# Altium schematic sheet [0X] - CPU_2.SchDoc
size A2; DocumentNumber: 2; SheetNumber: 2; SheetTotal: 4
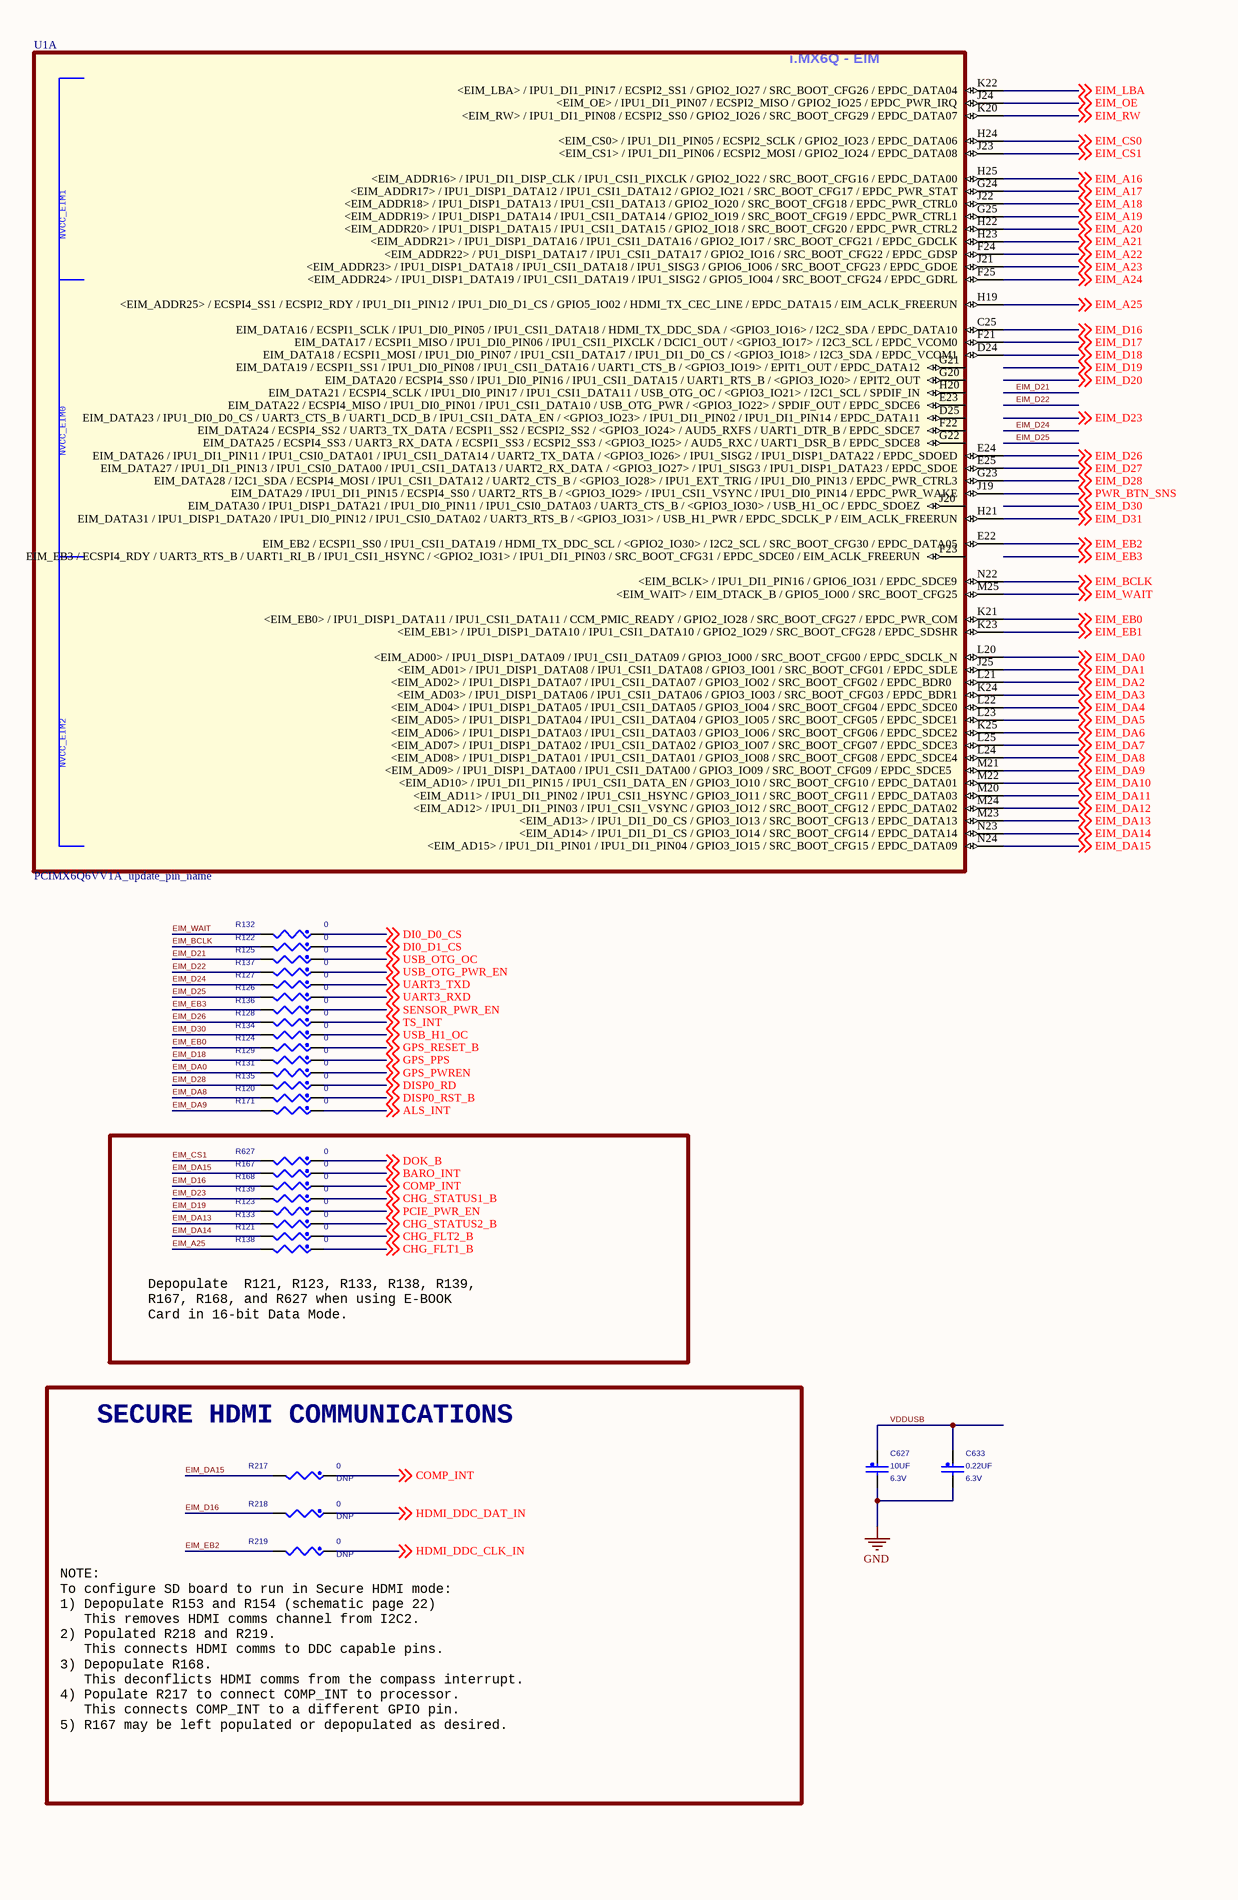
[diagram p0: [0X] - CPU_2.SchDoc, left]
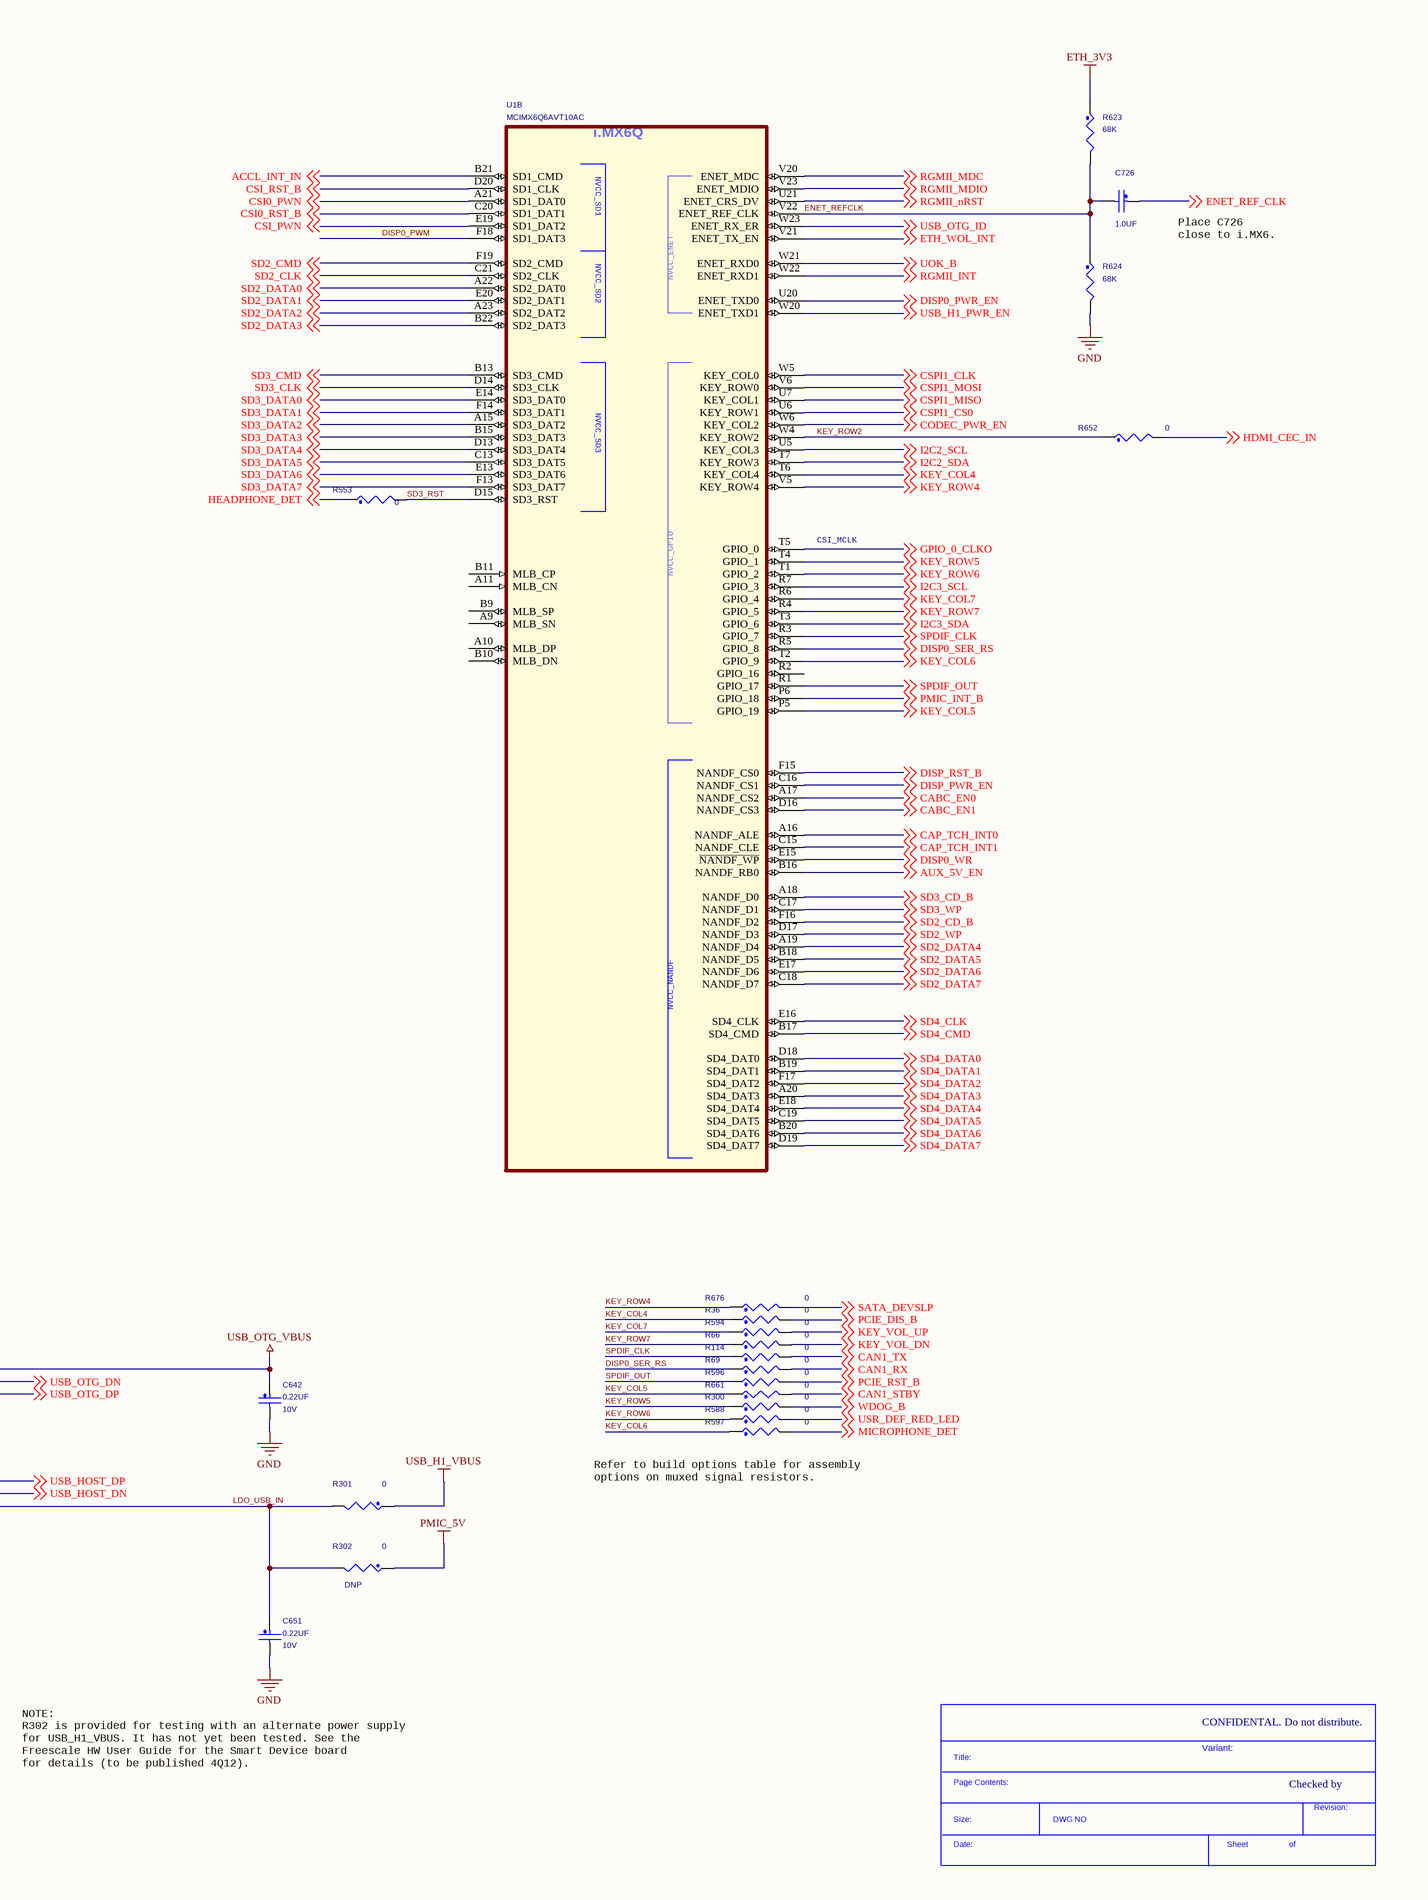
[diagram p1: [0X] - CPU_2.SchDoc, right]

## Parts
(Parts that share a designator on the sheet are numbered #1, #2 ... from top to bottom, then left to right.)
*  SDTitleBlock  (value not drawn)  (graphical)
C627  10UF  WVDC: 6.3V  [0603_CC]
C633  0.22UF  WVDC: 6.3V  [0201_CC]
C642  0.22UF  WVDC: 10V  [0201_CC]
C651  0.22UF  WVDC: 10V  [0201_CC]
C726  1.0UF  [0402_CC]
R36  0  [0402_CC]
R66  0  [0402_CC]
R69  0  [0402_CC]
R114  0  [0402_CC]
R120  0  [0402_CC]
R121  0  [0402_CC]
R122  0  [0402_CC]
R123  0  [0402_CC]
R124  0  [0402_CC]
R125  0  [0402_CC]
R126  0  [0402_CC]
R127  0  [0402_CC]
R128  0  [0402_CC]
R129  0  [0402_CC]
R131  0  [0402_CC]
R132  0  [0402_CC]
R133  0  [0402_CC]
R134  0  [0402_CC]
R135  0  [0402_CC]
R136  0  [0402_CC]
R137  0  [0402_CC]
R138  0  [0402_CC]
R139  0  [0402_CC]
R167  0  [0402_CC]
R168  0  [0402_CC]
R171  0  [0402_CC]
R217  0  ASSY_OPT: DNP  [0402_CC]
R218  0  ASSY_OPT: DNP  [0402_CC]
R219  0  ASSY_OPT: DNP  [0402_CC]
R300  0  [0402_CC]
R301  0  [0402_CC]
R302  0  ASSY_OPT: DNP  [0402_CC]
R553  0  [0402_CC]
R588  0  [0402_CC]
R594  0  [0402_CC]
R596  0  [0402_CC]
R597  0  [0402_CC]
R623  68K  [0402_CC]
R624  68K  [0402_CC]
R627  0  [0402_CC]
R652  0  [0402_CC]
R661  0  [0402_CC]
R676  0  [0402_CC]
U1#1  PCIMX6Q6VV1A_update_pin_name  (part A of 17)
U1#2  MCIMX6Q6AVT10AC  [BGA624_0P8_21X21]  (part B of 12)

## Blocks framed on the sheet
SECURE HDMI COMMUNICATIONS: R217-R219

## Nets
ETH_3V3: R623.1
GND: C627.2 C633.2 C642.2 C651.2 R624.2
PMIC_5V: R302.1
USB_H1_VBUS: R301.1
USB_OTG_VBUS: C642.1
ACCL_INT_IN: U1#2.B21(SD1_CMD) ; off-sheet ACCL_INT_IN
ALS_INT: R171.1 ; off-sheet ALS_INT
AUX_5V_EN: U1#2.B16(NANDF_RB0) ; off-sheet AUX_5V_EN
BARO_INT: R167.1 ; off-sheet BARO_INT
CABC_EN0: U1#2.A17(NANDF_CS2) ; off-sheet CABC_EN0
CABC_EN1: U1#2.D16(NANDF_CS3) ; off-sheet CABC_EN1
CAN1_RX: R69.2 ; off-sheet CAN1_RX
CAN1_STBY: R661.2 ; off-sheet CAN1_STBY
CAN1_TX: R114.2 ; off-sheet CAN1_TX
CAP_TCH_INT0: U1#2.A16(NANDF_ALE) ; off-sheet CAP_TCH_INT0
CAP_TCH_INT1: U1#2.C15(NANDF_CLE) ; off-sheet CAP_TCH_INT1
CHG_FLT1_B: R138.1 ; off-sheet CHG_FLT1_B
CHG_FLT2_B: R121.1 ; off-sheet CHG_FLT2_B
CHG_STATUS1_B: R139.1 ; off-sheet CHG_STATUS1_B
CHG_STATUS2_B: R133.1 ; off-sheet CHG_STATUS2_B
CODEC_PWR_EN: U1#2.W6(KEY_COL2) ; off-sheet CODEC_PWR_EN
COMP_INT: R168.1 R217.1 ; off-sheet COMP_INT
CSI0_PWN: U1#2.A21(SD1_DAT0) ; off-sheet CSI0_PWN
CSI0_RST_B: U1#2.C20(SD1_DAT1) ; off-sheet CSI0_RST_B
CSI_PWN: U1#2.E19(SD1_DAT2) ; off-sheet CSI_PWN
CSI_RST_B: U1#2.D20(SD1_CLK) ; off-sheet CSI_RST_B
CSPI1_CLK: U1#2.W5(KEY_COL0) ; off-sheet CSPI1_CLK
CSPI1_CS0: U1#2.U6(KEY_ROW1) ; off-sheet CSPI1_CS0
CSPI1_MISO: U1#2.U7(KEY_COL1) ; off-sheet CSPI1_MISO
CSPI1_MOSI: U1#2.V6(KEY_ROW0) ; off-sheet CSPI1_MOSI
DI0_D0_CS: R132.1 ; off-sheet DI0_D0_CS
DI0_D1_CS: R122.1 ; off-sheet DI0_D1_CS
DISP0_PWM: U1#2.F18(SD1_DAT3)
DISP0_PWR_EN: U1#2.U20(ENET_TXD0) ; off-sheet DISP0_PWR_EN
DISP0_RD: R135.1 ; off-sheet DISP0_RD
DISP0_RST_B: R120.1 ; off-sheet DISP0_RST_B
DISP0_SER_RS: R69.1 U1#2.R5(GPIO_8) ; off-sheet DISP0_SER_RS
DISP0_WR: U1#2.E15(~{NANDF_WP}) ; off-sheet DISP0_WR
DISP_PWR_EN: U1#2.C16(NANDF_CS1) ; off-sheet DISP_PWR_EN
DISP_RST_B: U1#2.F15(NANDF_CS0) ; off-sheet DISP_RST_B
DOK_B: R627.1 ; off-sheet DOK_B
EIM_A16: U1#1.H25(<EIM_ADDR16>_/_IPU1_DI1_DISP_CLK_/_IPU1_CSI1_PIXCLK_/_GPIO2_IO22_/_SRC_BOOT_CFG16_/_EPDC_DATA00) ; off-sheet EIM_A16
EIM_A17: U1#1.G24(<EIM_ADDR17>_/_IPU1_DISP1_DATA12_/_IPU1_CSI1_DATA12_/_GPIO2_IO21_/_SRC_BOOT_CFG17_/_EPDC_PWR_STAT) ; off-sheet EIM_A17
EIM_A18: U1#1.J22(<EIM_ADDR18>_/_IPU1_DISP1_DATA13_/_IPU1_CSI1_DATA13_/_GPIO2_IO20_/_SRC_BOOT_CFG18_/_EPDC_PWR_CTRL0) ; off-sheet EIM_A18
EIM_A19: U1#1.G25(<EIM_ADDR19>_/_IPU1_DISP1_DATA14_/_IPU1_CSI1_DATA14_/_GPIO2_IO19_/_SRC_BOOT_CFG19_/_EPDC_PWR_CTRL1) ; off-sheet EIM_A19
EIM_A20: U1#1.H22(<EIM_ADDR20>_/_IPU1_DISP1_DATA15_/_IPU1_CSI1_DATA15_/_GPIO2_IO18_/_SRC_BOOT_CFG20_/_EPDC_PWR_CTRL2) ; off-sheet EIM_A20
EIM_A21: U1#1.H23(<EIM_ADDR21>_/_IPU1_DISP1_DATA16_/_IPU1_CSI1_DATA16_/_GPIO2_IO17_/_SRC_BOOT_CFG21_/_EPDC_GDCLK) ; off-sheet EIM_A21
EIM_A22: U1#1.F24(<EIM_ADDR22>_/_PU1_DISP1_DATA17_/_IPU1_CSI1_DATA17_/_GPIO2_IO16_/_SRC_BOOT_CFG22_/_EPDC_GDSP) ; off-sheet EIM_A22
EIM_A23: U1#1.J21(<EIM_ADDR23>_/_IPU1_DISP1_DATA18_/_IPU1_CSI1_DATA18_/_IPU1_SISG3_/_GPIO6_IO06_/_SRC_BOOT_CFG23_/_EPDC_GDOE) ; off-sheet EIM_A23
EIM_A24: U1#1.F25(<EIM_ADDR24>_/_IPU1_DISP1_DATA19_/_IPU1_CSI1_DATA19_/_IPU1_SISG2_/_GPIO5_IO04_/_SRC_BOOT_CFG24_/_EPDC_GDRL) ; off-sheet EIM_A24
EIM_A25: R138.2 U1#1.H19(<EIM_ADDR25>_/_ECSPI4_SS1_/_ECSPI2_RDY_/_IPU1_DI1_PIN12_/_IPU1_DI0_D1_CS_/_GPIO5_IO02_/_HDMI_TX_CEC_LINE_/_EPDC_DATA15_/_EIM_ACLK_FREERUN) ; off-sheet EIM_A25
EIM_BCLK: R122.2 U1#1.N22(<EIM_BCLK>_/_IPU1_DI1_PIN16_/_GPIO6_IO31_/_EPDC_SDCE9) ; off-sheet EIM_BCLK
EIM_CS0: U1#1.H24(<EIM_CS0>_/_IPU1_DI1_PIN05_/_ECSPI2_SCLK_/_GPIO2_IO23_/_EPDC_DATA06) ; off-sheet EIM_CS0
EIM_CS1: R627.2 U1#1.J23(<EIM_CS1>_/_IPU1_DI1_PIN06_/_ECSPI2_MOSI_/_GPIO2_IO24_/_EPDC_DATA08) ; off-sheet EIM_CS1
EIM_D16: R168.2 R218.2 U1#1.C25(EIM_DATA16_/_ECSPI1_SCLK_/_IPU1_DI0_PIN05_/_IPU1_CSI1_DATA18_/_HDMI_TX_DDC_SDA_/_<GPIO3_IO16>_/_I2C2_SDA_/_EPDC_DATA10) ; off-sheet EIM_D16
EIM_D17: U1#1.F21(EIM_DATA17_/_ECSPI1_MISO_/_IPU1_DI0_PIN06_/_IPU1_CSI1_PIXCLK_/_DCIC1_OUT_/_<GPIO3_IO17>_/_I2C3_SCL_/_EPDC_VCOM0) ; off-sheet EIM_D17
EIM_D18: R129.2 U1#1.D24(EIM_DATA18_/_ECSPI1_MOSI_/_IPU1_DI0_PIN07_/_IPU1_CSI1_DATA17_/_IPU1_DI1_D0_CS_/_<GPIO3_IO18>_/_I2C3_SDA_/_EPDC_VCOM1) ; off-sheet EIM_D18
EIM_D19: R123.2 ; off-sheet EIM_D19
EIM_D21: R125.2
EIM_D22: R137.2
EIM_D23: R139.2 ; off-sheet EIM_D23
EIM_D24: R127.2
EIM_D25: R126.2
EIM_D26: R128.2 U1#1.E24(EIM_DATA26_/_IPU1_DI1_PIN11_/_IPU1_CSI0_DATA01_/_IPU1_CSI1_DATA14_/_UART2_TX_DATA_/_<GPIO3_IO26>_/_IPU1_SISG2_/_IPU1_DISP1_DATA22_/_EPDC_SDOED) ; off-sheet EIM_D26
EIM_D27: U1#1.E25(EIM_DATA27_/_IPU1_DI1_PIN13_/_IPU1_CSI0_DATA00_/_IPU1_CSI1_DATA13_/_UART2_RX_DATA_/_<GPIO3_IO27>_/_IPU1_SISG3_/_IPU1_DISP1_DATA23_/_EPDC_SDOE) ; off-sheet EIM_D27
EIM_D28: R135.2 U1#1.G23(EIM_DATA28_/_I2C1_SDA_/_ECSPI4_MOSI_/_IPU1_CSI1_DATA12_/_UART2_CTS_B_/_<GPIO3_IO28>_/_IPU1_EXT_TRIG_/_IPU1_DI0_PIN13_/_EPDC_PWR_CTRL3) ; off-sheet EIM_D28
EIM_D30: R134.2 ; off-sheet EIM_D30
EIM_D31: U1#1.H21(EIM_DATA31_/_IPU1_DISP1_DATA20_/_IPU1_DI0_PIN12_/_IPU1_CSI0_DATA02_/_UART3_RTS_B_/_<GPIO3_IO31>_/_USB_H1_PWR_/_EPDC_SDCLK_P_/_EIM_ACLK_FREERUN) ; off-sheet EIM_D31
EIM_DA0: R131.2 U1#1.L20(<EIM_AD00>_/_IPU1_DISP1_DATA09_/_IPU1_CSI1_DATA09_/_GPIO3_IO00_/_SRC_BOOT_CFG00_/_EPDC_SDCLK_N) ; off-sheet EIM_DA0
EIM_DA1: U1#1.J25(<EIM_AD01>_/_IPU1_DISP1_DATA08_/_IPU1_CSI1_DATA08_/_GPIO3_IO01_/_SRC_BOOT_CFG01_/_EPDC_SDLE) ; off-sheet EIM_DA1
EIM_DA2: U1#1.L21(<EIM_AD02>_/_IPU1_DISP1_DATA07_/_IPU1_CSI1_DATA07_/_GPIO3_IO02_/_SRC_BOOT_CFG02_/_EPDC_BDR0) ; off-sheet EIM_DA2
EIM_DA3: U1#1.K24(<EIM_AD03>_/_IPU1_DISP1_DATA06_/_IPU1_CSI1_DATA06_/_GPIO3_IO03_/_SRC_BOOT_CFG03_/_EPDC_BDR1) ; off-sheet EIM_DA3
EIM_DA4: U1#1.L22(<EIM_AD04>_/_IPU1_DISP1_DATA05_/_IPU1_CSI1_DATA05_/_GPIO3_IO04_/_SRC_BOOT_CFG04_/_EPDC_SDCE0) ; off-sheet EIM_DA4
EIM_DA5: U1#1.L23(<EIM_AD05>_/_IPU1_DISP1_DATA04_/_IPU1_CSI1_DATA04_/_GPIO3_IO05_/_SRC_BOOT_CFG05_/_EPDC_SDCE1) ; off-sheet EIM_DA5
EIM_DA6: U1#1.K25(<EIM_AD06>_/_IPU1_DISP1_DATA03_/_IPU1_CSI1_DATA03_/_GPIO3_IO06_/_SRC_BOOT_CFG06_/_EPDC_SDCE2) ; off-sheet EIM_DA6
EIM_DA7: U1#1.L25(<EIM_AD07>_/_IPU1_DISP1_DATA02_/_IPU1_CSI1_DATA02_/_GPIO3_IO07_/_SRC_BOOT_CFG07_/_EPDC_SDCE3) ; off-sheet EIM_DA7
EIM_DA8: R120.2 U1#1.L24(<EIM_AD08>_/_IPU1_DISP1_DATA01_/_IPU1_CSI1_DATA01_/_GPIO3_IO08_/_SRC_BOOT_CFG08_/_EPDC_SDCE4) ; off-sheet EIM_DA8
EIM_DA9: R171.2 U1#1.M21(<EIM_AD09>_/_IPU1_DISP1_DATA00_/_IPU1_CSI1_DATA00_/_GPIO3_IO09_/_SRC_BOOT_CFG09_/_EPDC_SDCE5) ; off-sheet EIM_DA9
EIM_DA10: U1#1.M22(<EIM_AD10>_/_IPU1_DI1_PIN15_/_IPU1_CSI1_DATA_EN_/_GPIO3_IO10_/_SRC_BOOT_CFG10_/_EPDC_DATA01) ; off-sheet EIM_DA10
EIM_DA11: U1#1.M20(<EIM_AD11>_/_IPU1_DI1_PIN02_/_IPU1_CSI1_HSYNC_/_GPIO3_IO11_/_SRC_BOOT_CFG11_/_EPDC_DATA03) ; off-sheet EIM_DA11
EIM_DA12: U1#1.M24(<EIM_AD12>_/_IPU1_DI1_PIN03_/_IPU1_CSI1_VSYNC_/_GPIO3_IO12_/_SRC_BOOT_CFG12_/_EPDC_DATA02) ; off-sheet EIM_DA12
EIM_DA13: R133.2 U1#1.M23(<EIM_AD13>_/_IPU1_DI1_D0_CS_/_GPIO3_IO13_/_SRC_BOOT_CFG13_/_EPDC_DATA13) ; off-sheet EIM_DA13
EIM_DA14: R121.2 U1#1.N23(<EIM_AD14>_/_IPU1_DI1_D1_CS_/_GPIO3_IO14_/_SRC_BOOT_CFG14_/_EPDC_DATA14) ; off-sheet EIM_DA14
EIM_DA15: R167.2 R217.2 U1#1.N24(<EIM_AD15>_/_IPU1_DI1_PIN01_/_IPU1_DI1_PIN04_/_GPIO3_IO15_/_SRC_BOOT_CFG15_/_EPDC_DATA09) ; off-sheet EIM_DA15
EIM_EB0: R124.2 U1#1.K21(<EIM_EB0>_/_IPU1_DISP1_DATA11_/_IPU1_CSI1_DATA11_/_CCM_PMIC_READY_/_GPIO2_IO28_/_SRC_BOOT_CFG27_/_EPDC_PWR_COM) ; off-sheet EIM_EB0
EIM_EB1: U1#1.K23(<EIM_EB1>_/_IPU1_DISP1_DATA10_/_IPU1_CSI1_DATA10_/_GPIO2_IO29_/_SRC_BOOT_CFG28_/_EPDC_SDSHR) ; off-sheet EIM_EB1
EIM_EB2: R219.2 U1#1.E22(EIM_EB2_/_ECSPI1_SS0_/_IPU1_CSI1_DATA19_/_HDMI_TX_DDC_SCL_/_<GPIO2_IO30>_/_I2C2_SCL_/_SRC_BOOT_CFG30_/_EPDC_DATA05) ; off-sheet EIM_EB2
EIM_EB3: R136.2 ; off-sheet EIM_EB3
EIM_LBA: U1#1.K22(<EIM_LBA>_/_IPU1_DI1_PIN17_/_ECSPI2_SS1_/_GPIO2_IO27_/_SRC_BOOT_CFG26_/_EPDC_DATA04) ; off-sheet EIM_LBA
EIM_OE: U1#1.J24(<EIM_OE>_/_IPU1_DI1_PIN07_/_ECSPI2_MISO_/_GPIO2_IO25_/_EPDC_PWR_IRQ) ; off-sheet EIM_OE
EIM_RW: U1#1.K20(<EIM_RW>_/_IPU1_DI1_PIN08_/_ECSPI2_SS0_/_GPIO2_IO26_/_SRC_BOOT_CFG29_/_EPDC_DATA07) ; off-sheet EIM_RW
EIM_WAIT: R132.2 U1#1.M25(<EIM_WAIT>_/_EIM_DTACK_B_/_GPIO5_IO00_/_SRC_BOOT_CFG25) ; off-sheet EIM_WAIT
ENET_REF_CLK: C726.1 ; off-sheet ENET_REF_CLK
ENET_REFCLK: C726.2 R623.2 R624.1 U1#2.V22(ENET_REF_CLK)
ETH_WOL_INT: U1#2.V21(ENET_TX_EN) ; off-sheet ETH_WOL_INT
GPIO_0_CLKO: U1#2.T5(GPIO_0) ; off-sheet GPIO_0_CLKO
GPS_PPS: R129.1 ; off-sheet GPS_PPS
GPS_PWREN: R131.1 ; off-sheet GPS_PWREN
GPS_RESET_B: R124.1 ; off-sheet GPS_RESET_B
HDMI_CEC_IN: R652.2 ; off-sheet HDMI_CEC_IN
HDMI_DDC_CLK_IN: R219.1 ; off-sheet HDMI_DDC_CLK_IN
HDMI_DDC_DAT_IN: R218.1 ; off-sheet HDMI_DDC_DAT_IN
HEADPHONE_DET: R553.1 ; off-sheet HEADPHONE_DET
I2C2_SCL: U1#2.U5(KEY_COL3) ; off-sheet I2C2_SCL
I2C2_SDA: U1#2.T7(KEY_ROW3) ; off-sheet I2C2_SDA
I2C3_SCL: U1#2.R7(GPIO_3) ; off-sheet I2C3_SCL
I2C3_SDA: U1#2.T3(GPIO_6) ; off-sheet I2C3_SDA
KEY_COL4: R36.1 U1#2.T6(KEY_COL4) ; off-sheet KEY_COL4
KEY_COL5: R661.1 U1#2.P5(GPIO_19) ; off-sheet KEY_COL5
KEY_COL6: R597.1 U1#2.T2(GPIO_9) ; off-sheet KEY_COL6
KEY_COL7: R594.1 U1#2.R6(GPIO_4) ; off-sheet KEY_COL7
KEY_ROW2: R652.1 U1#2.W4(KEY_ROW2)
KEY_ROW4: R676.1 U1#2.V5(KEY_ROW4) ; off-sheet KEY_ROW4
KEY_ROW5: R300.1 U1#2.T4(GPIO_1) ; off-sheet KEY_ROW5
KEY_ROW6: R588.1 U1#2.T1(GPIO_2) ; off-sheet KEY_ROW6
KEY_ROW7: R66.1 U1#2.R4(GPIO_5) ; off-sheet KEY_ROW7
KEY_VOL_DN: R66.2 ; off-sheet KEY_VOL_DN
KEY_VOL_UP: R594.2 ; off-sheet KEY_VOL_UP
LDO_USB_IN: C651.1 R301.2 R302.2
MICROPHONE_DET: R597.2 ; off-sheet MICROPHONE_DET
PCIE_DIS_B: R36.2 ; off-sheet PCIE_DIS_B
PCIE_PWR_EN: R123.1 ; off-sheet PCIE_PWR_EN
PCIE_RST_B: R596.2 ; off-sheet PCIE_RST_B
PMIC_INT_B: U1#2.P6(GPIO_18) ; off-sheet PMIC_INT_B
PWR_BTN_SNS: U1#1.J19(EIM_DATA29_/_IPU1_DI1_PIN15_/_ECSPI4_SS0_/_UART2_RTS_B_/_<GPIO3_IO29>_/_IPU1_CSI1_VSYNC_/_IPU1_DI0_PIN14_/_EPDC_PWR_WAKE) ; off-sheet PWR_BTN_SNS
RGMII_INT: U1#2.W22(ENET_RXD1) ; off-sheet RGMII_INT
RGMII_MDC: U1#2.V20(ENET_MDC) ; off-sheet RGMII_MDC
RGMII_MDIO: U1#2.V23(ENET_MDIO) ; off-sheet RGMII_MDIO
RGMII_nRST: U1#2.U21(ENET_CRS_DV) ; off-sheet RGMII_nRST
SATA_DEVSLP: R676.2 ; off-sheet SATA_DEVSLP
SD2_CD_B: U1#2.F16(NANDF_D2) ; off-sheet SD2_CD_B
SD2_CLK: U1#2.C21(SD2_CLK) ; off-sheet SD2_CLK
SD2_CMD: U1#2.F19(SD2_CMD) ; off-sheet SD2_CMD
SD2_DATA0: U1#2.A22(SD2_DAT0) ; off-sheet SD2_DATA0
SD2_DATA1: U1#2.E20(SD2_DAT1) ; off-sheet SD2_DATA1
SD2_DATA2: U1#2.A23(SD2_DAT2) ; off-sheet SD2_DATA2
SD2_DATA3: U1#2.B22(SD2_DAT3) ; off-sheet SD2_DATA3
SD2_DATA4: U1#2.A19(NANDF_D4) ; off-sheet SD2_DATA4
SD2_DATA5: U1#2.B18(NANDF_D5) ; off-sheet SD2_DATA5
SD2_DATA6: U1#2.E17(NANDF_D6) ; off-sheet SD2_DATA6
SD2_DATA7: U1#2.C18(NANDF_D7) ; off-sheet SD2_DATA7
SD2_WP: U1#2.D17(NANDF_D3) ; off-sheet SD2_WP
SD3_CD_B: U1#2.A18(NANDF_D0) ; off-sheet SD3_CD_B
SD3_CLK: U1#2.D14(SD3_CLK) ; off-sheet SD3_CLK
SD3_CMD: U1#2.B13(SD3_CMD) ; off-sheet SD3_CMD
SD3_DATA0: U1#2.E14(SD3_DAT0) ; off-sheet SD3_DATA0
SD3_DATA1: U1#2.F14(SD3_DAT1) ; off-sheet SD3_DATA1
SD3_DATA2: U1#2.A15(SD3_DAT2) ; off-sheet SD3_DATA2
SD3_DATA3: U1#2.B15(SD3_DAT3) ; off-sheet SD3_DATA3
SD3_DATA4: U1#2.D13(SD3_DAT4) ; off-sheet SD3_DATA4
SD3_DATA5: U1#2.C13(SD3_DAT5) ; off-sheet SD3_DATA5
SD3_DATA6: U1#2.E13(SD3_DAT6) ; off-sheet SD3_DATA6
SD3_DATA7: U1#2.F13(SD3_DAT7) ; off-sheet SD3_DATA7
SD3_RST: R553.2 U1#2.D15(SD3_RST)
SD3_WP: U1#2.C17(NANDF_D1) ; off-sheet SD3_WP
SD4_CLK: U1#2.E16(SD4_CLK) ; off-sheet SD4_CLK
SD4_CMD: U1#2.B17(SD4_CMD) ; off-sheet SD4_CMD
SD4_DATA0: U1#2.D18(SD4_DAT0) ; off-sheet SD4_DATA0
SD4_DATA1: U1#2.B19(SD4_DAT1) ; off-sheet SD4_DATA1
SD4_DATA2: U1#2.F17(SD4_DAT2) ; off-sheet SD4_DATA2
SD4_DATA3: U1#2.A20(SD4_DAT3) ; off-sheet SD4_DATA3
SD4_DATA4: U1#2.E18(SD4_DAT4) ; off-sheet SD4_DATA4
SD4_DATA5: U1#2.C19(SD4_DAT5) ; off-sheet SD4_DATA5
SD4_DATA6: U1#2.B20(SD4_DAT6) ; off-sheet SD4_DATA6
SD4_DATA7: U1#2.D19(SD4_DAT7) ; off-sheet SD4_DATA7
SENSOR_PWR_EN: R136.1 ; off-sheet SENSOR_PWR_EN
SPDIF_CLK: R114.1 U1#2.R3(GPIO_7) ; off-sheet SPDIF_CLK
SPDIF_OUT: R596.1 U1#2.R1(GPIO_17) ; off-sheet SPDIF_OUT
TS_INT: R128.1 ; off-sheet TS_INT
UART3_RXD: R126.1 ; off-sheet UART3_RXD
UART3_TXD: R127.1 ; off-sheet UART3_TXD
UOK_B: U1#2.W21(ENET_RXD0) ; off-sheet UOK_B
USB_H1_OC: R134.1 ; off-sheet USB_H1_OC
USB_H1_PWR_EN: U1#2.W20(ENET_TXD1) ; off-sheet USB_H1_PWR_EN
USB_OTG_ID: U1#2.W23(ENET_RX_ER) ; off-sheet USB_OTG_ID
USB_OTG_OC: R125.1 ; off-sheet USB_OTG_OC
USB_OTG_PWR_EN: R137.1 ; off-sheet USB_OTG_PWR_EN
USR_DEF_RED_LED: R588.2 ; off-sheet USR_DEF_RED_LED
VDDUSB: C627.1 C633.1
WDOG_B: R300.2 ; off-sheet WDOG_B

Not connected (* = marked no-connect by the designer): U1#1 D25(EIM_DATA23_/_IPU1_DI0_D0_CS_/_UART3_CTS_B_/_UART1_DCD_B_/_IPU1_CSI1_DATA_EN_/_<GPIO3_IO23>_/_IPU1_DI1_PIN02_/_IPU1_DI1_PIN14_/_EPDC_DATA11) E23(__EIM_DATA22_/_ECSPI4_MISO_/_IPU1_DI0_PIN01_/_IPU1_CSI1_DATA10_/_USB_OTG_PWR_/_<GPIO3_IO22>_/_SPDIF_OUT_/_EPDC_SDCE6) F22(__EIM_DATA24_/_ECSPI4_SS2_/_UART3_TX_DATA_/_ECSPI1_SS2_/_ECSPI2_SS2_/_<GPIO3_IO24>_/_AUD5_RXFS_/_UART1_DTR_B_/_EPDC_SDCE7) F23(EIM_EB3_/_ECSPI4_RDY_/_UART3_RTS_B_/_UART1_RI_B_/_IPU1_CSI1_HSYNC_/_<GPIO2_IO31>_/_IPU1_DI1_PIN03_/_SRC_BOOT_CFG31_/_EPDC_SDCE0_/_EIM_ACLK_FREERUN) G20(EIM_DATA20_/_ECSPI4_SS0_/_IPU1_DI0_PIN16_/_IPU1_CSI1_DATA15_/_UART1_RTS_B_/_<GPIO3_IO20>_/_EPIT2_OUT) G21(__EIM_DATA19_/_ECSPI1_SS1_/_IPU1_DI0_PIN08_/_IPU1_CSI1_DATA16_/_UART1_CTS_B_/_<GPIO3_IO19>_/_EPIT1_OUT_/_EPDC_DATA12) G22(__EIM_DATA25_/_ECSPI4_SS3_/_UART3_RX_DATA_/_ECSPI1_SS3_/_ECSPI2_SS3_/_<GPIO3_IO25>_/_AUD5_RXC_/_UART1_DSR_B_/_EPDC_SDCE8) H20(EIM_DATA21_/_ECSPI4_SCLK_/_IPU1_DI0_PIN17_/_IPU1_CSI1_DATA11_/_USB_OTG_OC_/_<GPIO3_IO21>_/_I2C1_SCL_/_SPDIF_IN) J20(__EIM_DATA30_/_IPU1_DISP1_DATA21_/_IPU1_DI0_PIN11_/_IPU1_CSI0_DATA03_/_UART3_CTS_B_/_<GPIO3_IO30>_/_USB_H1_OC_/_EPDC_SDOEZ); U1#2 A9(MLB_SN) A10(MLB_DP) A11(MLB_CN) B9(MLB_SP) B10(MLB_DN) B11(MLB_CP) R2(GPIO_16)

## Notes on the sheet
- Place C726
  close to i.MX6.
- CSI_MCLK
- Depopulate  R121, R123, R133, R138, R139,
  R167, R168, and R627 when using E-BOOK
  Card in 16-bit Data Mode.
- Refer to build options table for assembly
  options on muxed signal resistors.
- CONFIDENTAL. Do not distribute.
- (near R219) NOTE:
  To configure SD board to run in Secure HDMI mode:
  1) Depopulate R153 and R154 (schematic page 22)
  This removes HDMI comms channel from I2C2.
  2) Populated R218 and R219.
  This connects HDMI comms to DDC capable pins.
  3) Depopulate R168.
  This deconflicts HDMI comms from the compass interrupt.
  4) Populate R217 to connect COMP_INT to processor.
  This connects COMP_INT to a different GPIO pin.
  5) R167 may be left populated or depopulated as desired.
- CLOCKS (CPU & PCIE)
- NOTE:
  R302 is provided for testing with an alternate power supply
  for USB_H1_VBUS. It has not yet been tested. See the
  Freescale HW User Guide for the Smart Device board
  for details (to be published 4Q12).
- Variant:
- Checked by
- (in symbol PCIMX6Q6VV1A, part B) i.MX6Q
- (in symbol PCIMX6Q6VV1A_update_pin_name, part A) i.MX6Q - EIM
- (in symbol SDTitleBlock) Title:; Page Contents:; Revision:; Size:; DWG NO; Date:; Sheet; of

## Library data of the parts
C627 = CAP_NP: CAP CER 10UF 6.3V 10% X5R 0603; CLASS: DISCRETE; SIGNAL_MODEL: DEFAULT_CAPACITOR_1e+07pF_2_1; AGILE_PN: 150-77832; MFG_NAME01: TDK; MFG_PN01: C1608X5R0J106KT; CAD_APPROVED: Yes; FPLIST: CC0603_OV,CC0603,0603_CC; PRIORITY_PN: 021-00276; Tolerance: 10%; ROHS: Yes; HEIGHT: 1.0MM; VOLTAGE: 6.3V
C633 = CAP_NP: CAP CER 0.22UF 6.3V 20% X5R 0201; CLASS: DISCRETE; SIGNAL_MODEL: DEFAULT_CAPACITOR_220000pF_2_1; ROOM: CPU; AGILE_PN: 150-77852; MFG_NAME01: TAIYO YUDEN; MFG_PN01: JMK063BJ224MP-F; CAD_APPROVED: Yes; FPLIST: CC0201,CC0201_HD,0201_CC,cc_0201_cir; PRIORITY_PN: 021-00278; Tolerance: 20%; ROHS: Yes; HEIGHT: 0.33 MM; VOLTAGE: 6.3V
C642 = CAP_NP: CAP CER 0.22UF 10V 20% X5R 0201; CLASS: DISCRETE; SIGNAL_MODEL: DEFAULT_CAPACITOR_220000pF_2_1; ROOM: CPU; AGILE_PN: 150-78815; MFG_NAME01: Taiyo Yuden; MFG_PN01: LMK063BJ224MP-F; CAD_APPROVED: Yes; FPLIST: CC0201,CC0201_HD,0201_CC,CC_0201_CIR,0201_CC_012SM; PRIORITY_PN: 021-00278; Tolerance: 20%; ROHS: Yes; HEIGHT: 0.33MM; VOLTAGE: 10V
C651 = CAP_NP: CAP CER 0.22UF 10V 20% X5R 0201; CLASS: DISCRETE; SIGNAL_MODEL: DEFAULT_CAPACITOR_220000pF_2_1; PRIORITY_PN: 021-00278; FPLIST: CC0201,CC0201_HD,0201_CC,CC_0201_CIR,0201_CC_012SM; CAD_APPROVED: Yes; MFG_PN01: LMK063BJ224MP-F; MFG_NAME01: Taiyo Yuden; AGILE_PN: 150-78815; ROOM: CPU; VOLTAGE: 10V; HEIGHT: 0.33MM; ROHS: Yes; Tolerance: 20%
C726 = CAP_NP: CAP CER 1.0UF 10V 10% X5R 0402; CLASS: DISCRETE; AGILE_PN: 150-75772; MFG_NAME01: YAGEO AMERICA; MFG_PN01: CC0402KRX5R6BB105; CAD_APPROVED: Yes; FPLIST: CC0402_25,CC0402_HD,0402_CC; SIGNAL_MODEL: DEFAULT_CAPACITOR_1e+06pF_2_1; ROHS: Yes; HEIGHT: 0.6MM
R36 R122 R123 R125 R126 R132 R134 R136 R137 R168 R171 R217-R219 R588 R627 = RES: RES MF ZERO OHM 1/10W -- 0402; CLASS: DISCRETE; FPLIST: RC0402_25,RC0402_HD,RC0402_X2,0402_CC; CAD_APPROVED: Yes; MFG_PN01: ERJ-2GE0R00X; MFG_NAME01: Panasonic; AGILE_PN: 470-79965; SIGNAL_MODEL: DEFAULT_RESISTOR_0.001OHM_2_1; ROHS: Yes
R66 R69 R114 R120 R121 R124 R127-R129 R131 R133 R135 R138 R139 R167 R594 R596 R597 R661 R676 = RES: RES MF ZERO OHM 1/10W -- 0402; CLASS: DISCRETE; AGILE_PN: 470-79965; MFG_NAME01: Panasonic; MFG_PN01: ERJ-2GE0R00X; CAD_APPROVED: Yes; FPLIST: RC0402_25,RC0402_HD,RC0402_X2,0402_CC; SIGNAL_MODEL: DEFAULT_RESISTOR_0.001OHM_2_1; ROHS: Yes
R300 = RES: RES MF ZERO OHM 1/10W -- 0402; CLASS: DISCRETE; SIGNAL_MODEL: DEFAULT_RESISTOR_0.001OHM_2_1; AGILE_PN: 470-79965; MFG_NAME01: Panasonic; MFG_PN01: ERJ-2GE0R00X; CAD_APPROVED: Yes; FPLIST: RC0402_25,RC0402_HD,RC0402_X2,0402_CC; ROHS: Yes
R301 = RES: RES MF ZERO OHM 1/10W -- 0402; CLASS: DISCRETE; SIGNAL_MODEL: DEFAULT_RESISTOR_0.001OHM_2_1; AGILE_PN: 470-79965; MFG_NAME01: Panasonic; MFG_PN01: ERJ-2GE0R00X; CAD_APPROVED: Yes; FPLIST: RC0402_25,RC0402_HD,RC0402_X2,0402_CC; PRIORITY_PN: 006-00559; ROOM: HDMI; ROHS: Yes
R302 R652 = RES: RES MF ZERO OHM 1/10W -- 0402; CLASS: DISCRETE; ROOM: HDMI; PRIORITY_PN: 006-00559; FPLIST: RC0402_25,RC0402_HD,RC0402_X2,0402_CC; CAD_APPROVED: Yes; MFG_PN01: ERJ-2GE0R00X; MFG_NAME01: Panasonic; AGILE_PN: 470-79965; SIGNAL_MODEL: DEFAULT_RESISTOR_0.001OHM_2_1; ROHS: Yes
R553 = RES: RES MF ZERO OHM 1/10W -- 0402; CLASS: DISCRETE; PRIORITY_PN: 006-00559; FPLIST: RC0402_25,RC0402_HD,RC0402_X2,0402_CC; CAD_APPROVED: Yes; MFG_PN01: ERJ-2GE0R00X; MFG_NAME01: Panasonic; AGILE_PN: 470-79965; ROOM: ATLAS-AP; SIGNAL_MODEL: DEFAULT_RESISTOR_0.001OHM_2_1; ROHS: Yes
R623 = RES: RES MF 68K  1/16W 1% 0402; CLASS: DISCRETE; FPLIST: RC0402_25,RC0402_HD,0402_CC; CAD_APPROVED: Yes; MFG_PN01: RK73H1ETTP6802F; MFG_NAME01: KOA SPEER; AGILE_PN: 470-31042; SIGNAL_MODEL: DEFAULT_RESISTOR_68000OHM_2_1; ROHS: Yes; Tolerance: 1%
R624 = RES: RES MF 68K  1/16W 1% 0402; CLASS: DISCRETE; AGILE_PN: 470-31042; MFG_NAME01: KOA SPEER; MFG_PN01: RK73H1ETTP6802F; CAD_APPROVED: Yes; FPLIST: RC0402_25,RC0402_HD,0402_CC; SIGNAL_MODEL: DEFAULT_RESISTOR_68000OHM_2_1; Tolerance: 1%; ROHS: Yes
U1#1 = PCIMX6Q6VV1A_update_pin_name: CLASS: IC
U1#2 = PCIMX6Q6VV1A: IC MCU MX6QUAD ARM CORTEX-A9 FCPBGA624; CAD_APPROVED: Yes; MFG_NAME01: FREESCALE SEMICONDUCTOR; AGILE_PN: 344-01218; CLASS: IC; HEIGHT: 2.16MM; ROHS: Yes; MFG_PN01: MCIMX6Q6AVT10AC